# EAGLE design TankFuzz (EAGLE 9.6.2)
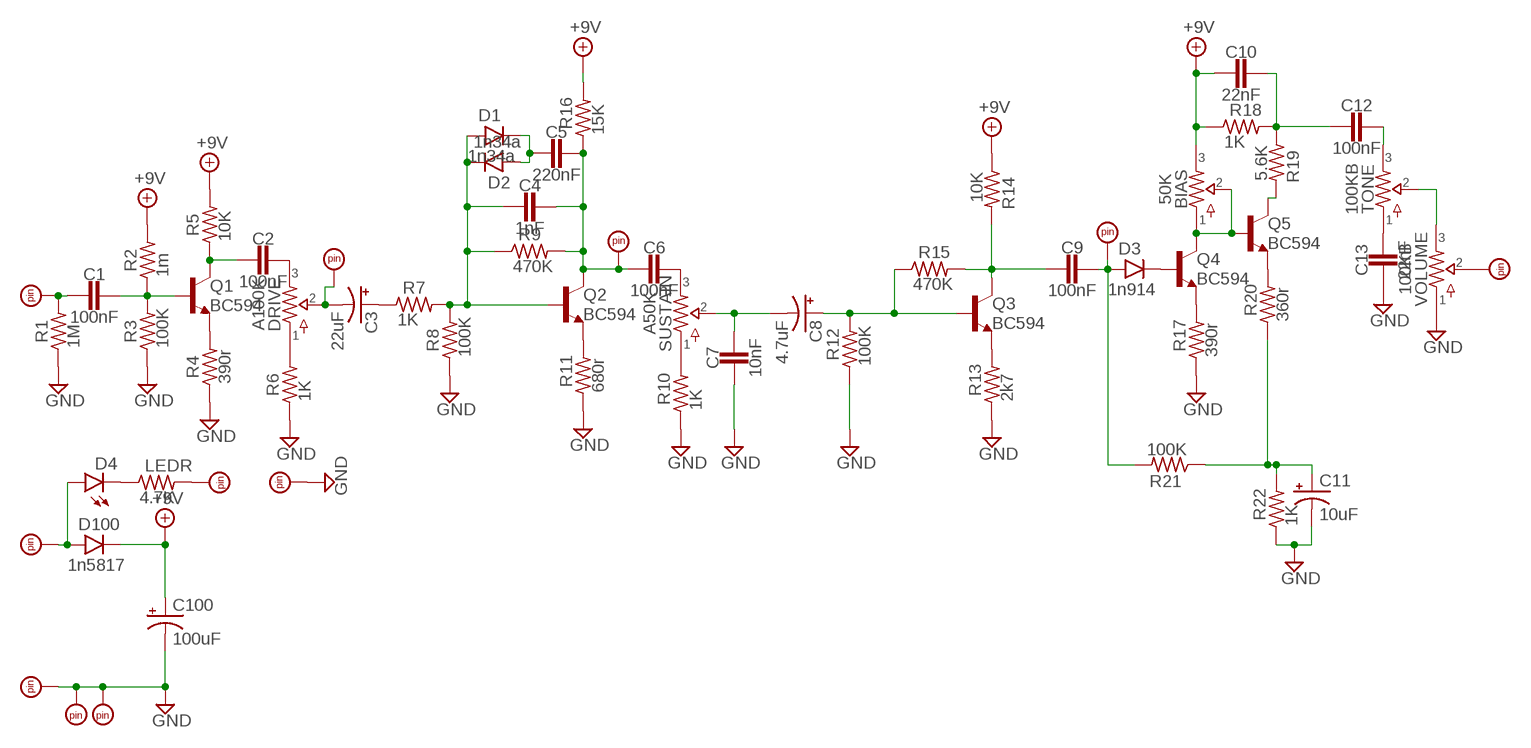
[diagram p0: schematic, sheet 1]

## Parts
BIAS  50K  TRIMMERTRIM3  [TRIM3]
C1  100nF  CAP.3  [0.2".MED]
C2  100nF  CAP.3  [0.2".MED]
C3  22uF  0501  [050_020_1]
C4  1nF  CAP.3  [0.2".MED]
C5  220nF  CAP.3  [0.2".MED]
C6  100nF  CAP.3  [0.2".MED]
C7  10nF  CAP.3  [0.2".MED]
C8  4.7uF  0501  [050_020_1]
C9  100nF  CAP.3  [0.2".MED]
C10  22nF  CAP.3  [0.2".MED]
C11  10uF  0501  [050_020_1]
C12  100nF  CAP.3  [0.2".MED]
C13  22nF  CAP.3  [0.2".MED]
C100  100uF  0501  [050_020_1]
D1  1n34a  DO35.3  [DO35-3]
D2  1n34a  DO35.3  [DO35-3]
D3  1n914  DO35.3  [DO35-3]
D4  LED3MM  [LED3MM]
D100  1n5817  DO41.3  [DO41-3]
DRIVE  A100K  16MM.1  [16MM_B.MOUNT]
LEDR  4.7K  RESISTORS.3B  [R0207/3]
Q1  BC594  2N5088  [TO92]
Q2  BC594  2N5088  [TO92]
Q3  BC594  2N5088  [TO92]
Q4  BC594  2N5088  [TO92]
Q5  BC594  2N5088  [TO92]
R1  1M  RESISTORS.3B  [R0207/3]
R2  1m  RESISTORS.3B  [R0207/3]
R3  100K  RESISTORS.3B  [R0207/3]
R4  390r  RESISTORS.3B  [R0207/3]
R5  10K  RESISTORS.3B  [R0207/3]
R6  1K  RESISTORS.3B  [R0207/3]
R7  1K  RESISTORS.3B  [R0207/3]
R8  100K  RESISTORS.3B  [R0207/3]
R9  470K  RESISTORS.3B  [R0207/3]
R10  1K  RESISTORS.3B  [R0207/3]
R11  680r  RESISTORS.3B  [R0207/3]
R12  100K  RESISTORS.3B  [R0207/3]
R13  2k7  RESISTORS.3B  [R0207/3]
R14  10K  RESISTORS.3B  [R0207/3]
R15  470K  RESISTORS.3B  [R0207/3]
R16  15K  RESISTORS.3B  [R0207/3]
R17  390r  RESISTORS.3B  [R0207/3]
R18  1K  RESISTORS.3B  [R0207/3]
R19  5.6K  RESISTORS.3B  [R0207/3]
R20  360r  RESISTORS.3B  [R0207/3]
R21  100K  RESISTORS.3B  [R0207/3]
R22  1K  RESISTORS.3B  [R0207/3]
SUSTAIN  A50K  16MM.1  [16MM_B.MOUNT]
TONE  100KB  16MM.1  [16MM_B.MOUNT]
U$1  PADS.RND_NL  [PAD2]
U$2  PADS.RND_NL  [PAD2]
U$3  PADS.RND_NL  [PAD2]
U$4  PADS.RND_NL  [PAD2]
U$5  PADS.RND_NL  [PAD2]
U$6  PADS.RND_NL  [PAD2]
U$8  PADS.RND_NL  [PAD2]
U$9  PADS.RND_NL  [PAD2]
U$10  PADS.RND_NL  [PAD2]
U$11  PADS.RND_NL  [PAD2]
U$12  PADS.RND_NL  [PAD2]
VOLUME  100KB  16MM.1  [16MM_B.MOUNT]

## Nets
+9V: BIAS.3 BIAS.6 C10.2 C100.+ D100.C R2.2 R5.2 R14.1 R16.2 R18.1
GND: C7.2 C11.- C13.2 C100.- R1.1 R3.1 R4.1 R6.1 R8.1 R10.1 R11.1 R12.1 R13.1 R17.1 R22.1 U$4.P$1 U$6.P$1 U$8.P$1 U$9.P$1 VOLUME.1
N$1: C1.2 R1.2 U$1.P$1
N$2: C1.1 Q1.2(B) R2.1 R3.2
N$3: Q1.3(E) R4.2
N$4: C2.2 Q1.1(C) R5.1
N$5: C2.1 DRIVE.3
N$6: DRIVE.1 R6.2
N$7: C3.- DRIVE.2 U$10.P$1
N$8: C3.+ R7.1
N$9: C6.1 SUSTAIN.3
N$10: Q2.3(E) R11.2
N$11: C4.1 C5.1 C6.2 Q2.1(C) R9.2 R16.1 U$11.P$1
N$12: C5.2 D1.C D2.A
N$13: C4.2 D1.A D2.C Q2.2(B) R7.2 R8.2 R9.1
N$14: R10.2 SUSTAIN.1
N$15: C7.1 C8.- SUSTAIN.2
N$16: C8.+ Q3.2(B) R12.2 R15.1
N$17: Q3.3(E) R13.2
N$18: C9.2 Q3.1(C) R14.2 R15.2
N$19: C9.1 D3.A R21.2 U$12.P$1
N$20: D3.C Q4.2(B)
N$21: Q4.3(E) R17.2
N$22: BIAS.1 BIAS.2 BIAS.4 BIAS.5 Q4.1(C) Q5.2(B)
N$23: C12.1 TONE.3
N$24: C10.1 C12.2 R18.2 R19.1
N$25: Q5.1(C) R19.2
N$26: Q5.3(E) R20.2
N$27: C11.+ R20.1 R21.1 R22.2
N$28: TONE.2 VOLUME.3
N$29: C13.1 TONE.1
N$30: U$2.P$1 VOLUME.2
N$31: LEDR.2 U$5.P$1
N$33: D4.A D100.A U$3.P$1
N$34: D4.K(C) LEDR.1

## Library data of the parts
BIAS = potentiometers:TRIMMER: Trimpots
C1 C2 C4-C7 C9 C10 C12 C13 = caps-film:CAP: For Ceramic, Film, MLCC caps
C3 C8 C11 C100 = caps-elec:050: 0.22 - 100uF Xicon values at Mouser.com: 10V: 10 - 100uF; 16V: 2.2 - 47uF; 25V: 0.47 - 47uF; 50V: 0.22 - 22uF
D1-D3 = diodes:DO35: DO-35 Package Diodes: 1N914
D4 = diodes:LED
D100 = diodes:DO41: DO-41 Package Diodes: 1N4001 - 1N40019 Zener Diodes: 1N4728 - 1N4764
DRIVE SUSTAIN TONE VOLUME = potentiometers:16MM: 16mm Poteniometers
LEDR R1-R22 = resistors:RESISTORS
Q1-Q5 = transistors-BJT:2N5088: NPN - 2n5088, 2n5089, 2n3904, MPSA18 [C]-B-E pinout 2n5088: http://smallbear-electronics.mybigcommerce.com/transistor-2n5088/ 2n5089: http://smallbear-electronics.mybigcommerce.com/transistor-2n5089/ 2n5089: http://smallbear-electronics.mybigcommerce.com/transistor-2n5089-motorola/ 2n3904: http://smallbear-electronics.mybigcommerce.com/transistor-2n3904/ MPSA18: http://smallbear-electronics.mybigcommerce.com/transistor-mpsa18/
U$1-U$6 U$8-U$12 = supply pins:PADS.: Pads For I/O connections or test point pads on PCBs.

## Board
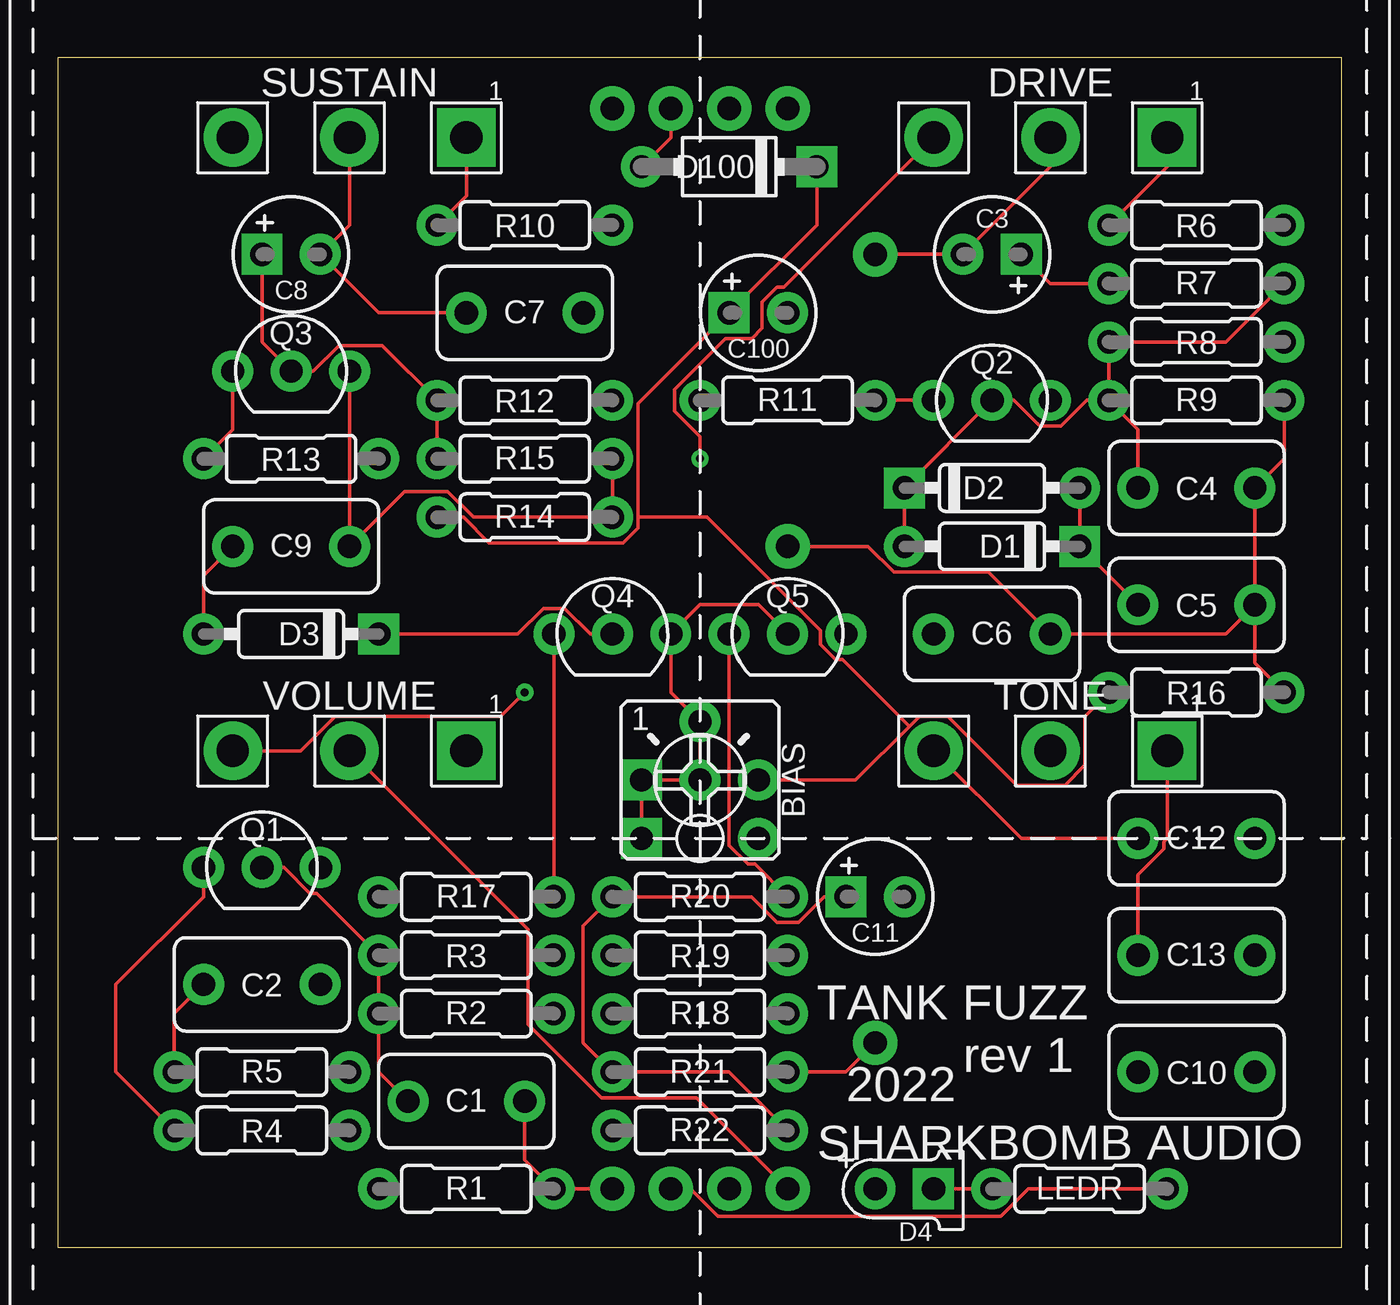
[diagram p1: board, top side]
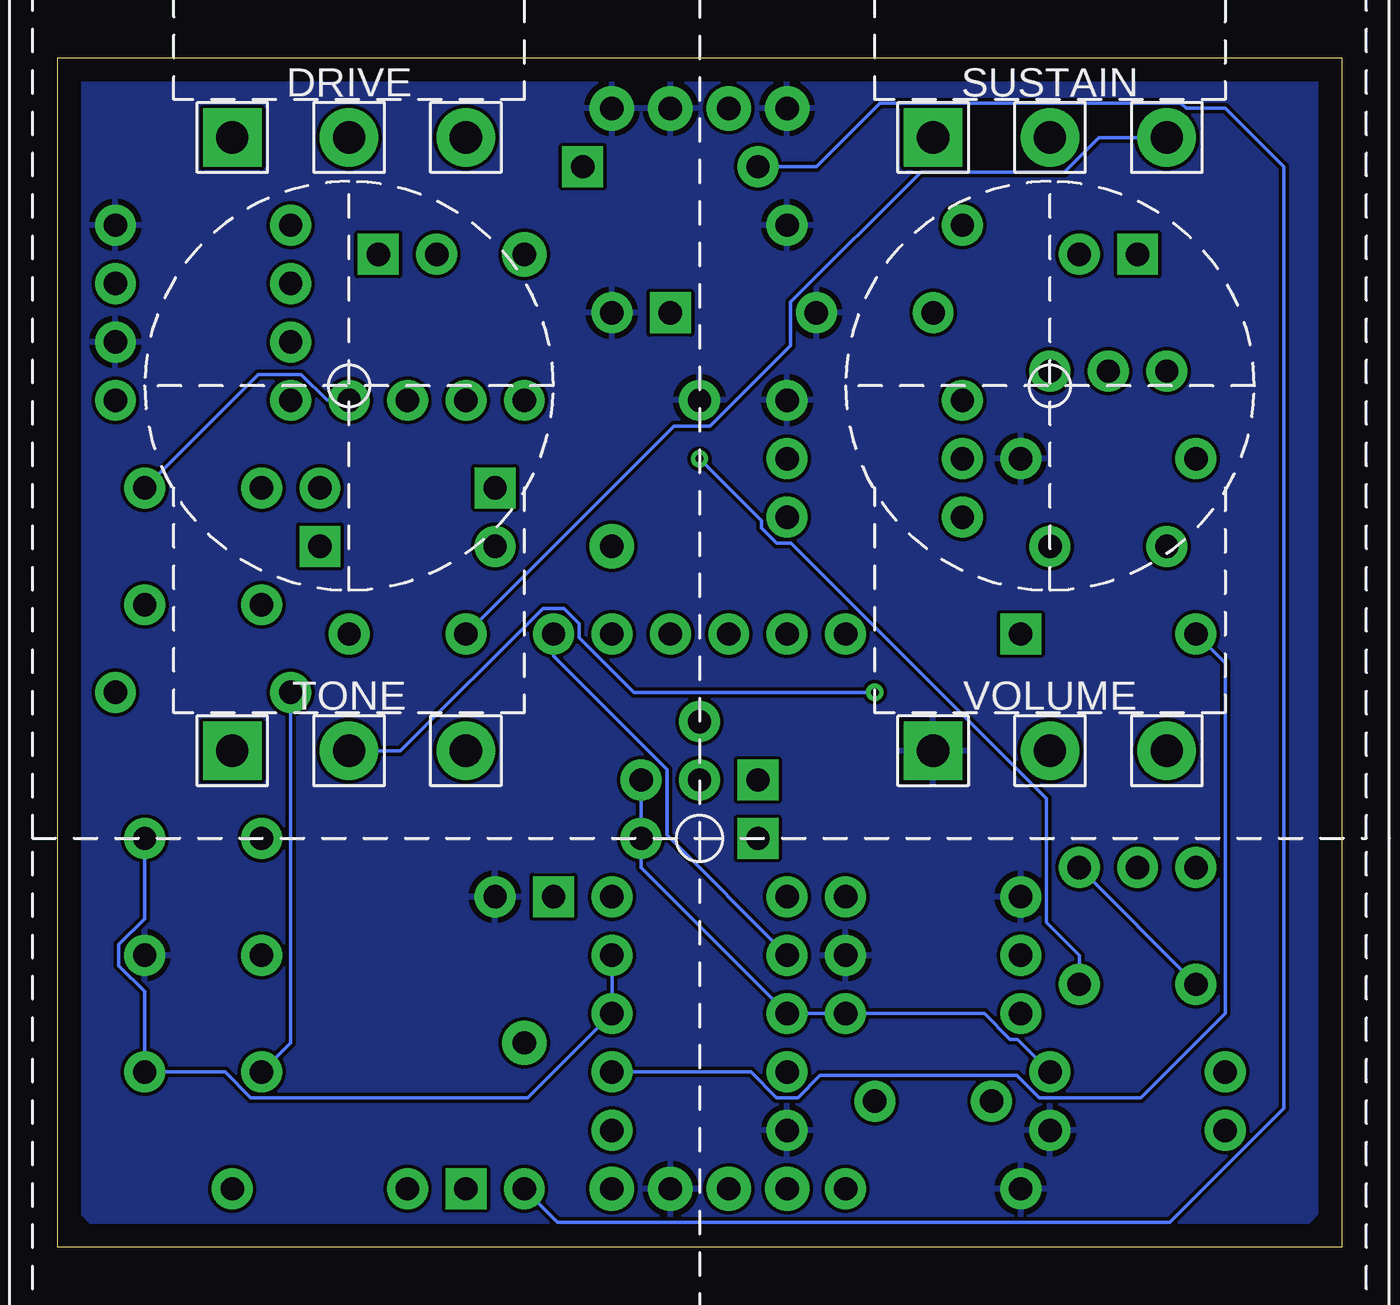
[diagram p2: board, bottom side, seen from below]

Size 55.86 x 51.74 mm. Coordinates in mm from the lower left corner, seen from the top.
Outline: 0,0 55.86,0 55.86,51.74 0,51.74 0,0
Copper layers (1*16): Top 0.035mm / dielectric 1.5mm / Bottom 0.035mm
Design rules "default": minimum track width 6mil, minimum drill 0.35mm, track to track 6mil, track to pad 6mil, pad to pad 6mil, via to via 6mil, smd to smd 6mil, copper to edge 40mil, drill to drill 6mil, minimum pad ring 10mil, minimum via ring 8mil, stop-mask expansion 4mil, vias tented up to drill 0mil, thermal gap 10mil

### Footprints (pad centres in the part's own frame; a part is rotated, then mirrored left to right if it is on the bottom)
TRIM3 = drill 1.016 pad 1.778 square: 1 -2.54,0; 4 -2.54,-2.54 | drill 1.016 pad 1.778: 2 0,2.54; 3 2.54,0; 5 0,0; 6 2.54,-2.54
0.2".MED = drill 1.016 pad 1.778: 1 -2.54,0; 2 2.54,0
050_020_1 = drill 1.016 pad 1.778 square: + -1.27,0 | drill 1.016 pad 1.778: - 1.27,0
DO35-3 = drill 1.016 pad 1.778: A 3.81,0 | drill 1.016 pad 1.778 square: C -3.81,0
LED3MM = drill 1.016 pad 1.778: A -1.27,0 | drill 1.016 pad 1.778 square: K 1.27,0
DO41-3 = drill 1.016 pad 1.778: A 3.81,0 | drill 1.016 pad 1.778 square: C -3.81,0
16MM_B.MOUNT = drill 1.4 pad 2.54 square: 1 5.08,0 | drill 1.4 pad 2.54: 2 0,0; 3 -5.08,0
R0207/3 = drill 1.016 pad 1.778: 1 -3.81,0; 2 3.81,0
TO92 = drill 1.016 pad 1.778: 1 -2.54,0; 2 0,0; 3 2.54,0
PAD2 = drill 1.016 pad 1.93: P$1 0,0

### Placement (x,y rotation side)
BIAS  27.94,20.32 0 top
C1  17.78,6.35 0 top
C2  8.89,11.43 180 top
C3  40.64,43.18 180 top
C4  49.53,33.02 180 top
C5  49.53,27.94 180 top
C6  40.64,26.67 0 top
C7  20.32,40.64 0 top
C8  10.16,43.18 0 top
C9  10.16,30.48 0 top
C10  49.53,7.62 180 top
C11  35.56,15.24 0 top
C12  49.53,17.78 0 top
C13  49.53,12.7 0 top
C100  30.48,40.64 0 top
D1  40.64,30.48 180 top
D2  40.64,33.02 0 top
D3  10.16,26.67 180 top
D4  36.83,2.54 0 top
D100  29.21,46.99 180 top
DRIVE  43.18,48.26 0 top
LEDR  44.45,2.54 0 top
Q1  8.89,16.51 180 top
Q2  40.64,36.83 180 top
Q3  10.16,38.1 180 top
Q4  24.13,26.67 180 top
Q5  31.75,26.67 180 top
R1  17.78,2.54 0 top
R2  17.78,10.16 0 top
R3  17.78,12.7 180 top
R4  8.89,5.08 180 top
R5  8.89,7.62 0 top
R6  49.53,44.45 180 top
R7  49.53,41.91 0 top
R8  49.53,39.37 180 top
R9  49.53,36.83 0 top
R10  20.32,44.45 180 top
R11  31.75,36.83 0 top
R12  20.32,36.83 180 top
R13  10.16,34.29 180 top
R14  20.32,31.75 0 top
R15  20.32,34.29 0 top
R16  49.53,24.13 180 top
R17  17.78,15.24 0 top
R18  27.94,10.16 0 top
R19  27.94,12.7 180 top
R20  27.94,15.24 0 top
R21  27.94,7.62 0 top
R22  27.94,5.08 0 top
SUSTAIN  12.7,48.26 0 top
TONE  43.18,21.59 0 top
U$1  24.13,2.54 0 top
U$2  31.75,2.54 0 top
U$3  26.67,49.53 0 top
U$4  29.21,2.54 0 top
U$5  26.67,2.54 0 top
U$6  29.21,49.53 0 top
U$7  [125B]  27.94,17.78 0 top
U$8  24.13,49.53 0 top
U$9  31.75,49.53 0 top
U$10  35.56,43.18 0 top
U$11  31.75,30.48 0 top
U$12  35.56,8.89 0 top
VOLUME  12.7,21.59 0 top

### Tracks (layer width: path | path; a pad name or v marks a point on that pad's centre or on a via)
+9V
  Top 0.152: D100.C 33.02,44.45 C100.+ 25.25,36.68 25.25,31.75 | R14.1 17.66,31.75 18.78,30.63 24.59,30.63 25.25,31.29 25.25,31.75 | R16.2 44.68,23.09 44.68,20.97 43.8,20.09 41.72,20.09 38.72,23.09 37.48,23.09 37.04,22.65 | BIAS.3 34.71,20.32 37.04,22.65 | 37.04,22.65 34.14,25.55 33.83,25.55 33.17,26.21 33.17,26.83 28.25,31.75 25.25,31.75
  Bottom 0.152: R5.2 14.12,9.04 14.43,9.04 15.55,10.16 R2.2 R18.1 30.48,16.51 BIAS.6 BIAS.3 | C10.2 45.72,8.89 R16.2
GND
  pour Bottom: 0,50.8 54.61,50.8 55.88,49.53 55.88,2.54 53.34,0 2.54,0 0,2.54
N$1
  Top 0.152: U$1.P$1 R1.2 20.32,3.81 C1.2
N$2
  Top 0.152: C1.1 13.97,7.62 R2.1 R3.2 11.28,15.39 10.97,15.39 9.85,16.51 Q1.2
N$3
  Top 0.152: Q1.3 6.35,15.24 2.54,11.43 2.54,7.62 R4.2
N$4
  Top 0.152: R5.1 5.08,10.16 C2.2
  Bottom 0.152: C2.2 Q1.1
N$5  (via drill 0.35)
  Top 0.152: DRIVE.3 31.6,41.76 31.29,41.76 30.63,41.1 30.63,39.96 30.19,39.52 29.05,39.52 26.82,37.29 26.82,36.37 27.94,35.25 v27.94,34.29
  Bottom 0.152: C2.1 11.43,12.7 12.85,14.12 12.85,19.53 23.96,30.63 24.59,30.63 25.25,31.29 25.25,31.6 v27.94,34.29
N$6
  Top 0.152: DRIVE.1 48.26,46.99 R6.2
N$7
  Top 0.152: DRIVE.2 43.18,46.99 C3.- U$10.P$1
N$8
  Top 0.152: R7.1 43.18,41.91 C3.+
N$9
  Bottom 0.152: C6.1 29.06,35.71 27.48,35.71 23.98,39.21 23.98,41.1 18.32,46.76 12.08,46.76 10.58,48.26 SUSTAIN.3
N$10
  Top 0.152: R11.2 Q2.3
N$11
  Top 0.152: R9.2 53.34,34.29 C4.1 C5.1 | R16.1 52.07,25.4 C5.1 | C5.1 50.8,26.67 C6.2 40.49,29.36 36.37,29.36 35.25,30.48 U$11.P$1
  Bottom 0.152: Q2.1 44.14,36.83 45.26,37.95 47.14,37.95 C4.1
N$12
  Top 0.152: C5.2 D1.C D2.A
N$13
  Top 0.152: R7.2 50.8,39.37 R8.2 R9.1 | R9.1 46.99,35.56 C4.2 | R9.1 44.76,36.83 43.64,35.71 42.72,35.71 41.6,36.83 Q2.2 D2.C D1.A
N$14
  Top 0.152: SUSTAIN.1 17.78,45.72 R10.2
N$15
  Top 0.152: SUSTAIN.2 12.7,44.45 C8.- 13.97,40.64 C7.1
N$16
  Top 0.152: R15.1 R12.2 14.12,39.22 12.24,39.22 11.12,38.1 Q3.2 8.89,39.37 C8.+
N$17
  Top 0.152: Q3.3 7.62,35.56 R13.2
N$18
  Top 0.152: Q3.1 C9.2 15.09,32.87 16.97,32.87 18.09,31.75 R14.2 R15.2
N$19
  Top 0.152: D3.A 6.35,29.21 C9.1 | R21.2 34.29,7.62 U$12.P$1
  Bottom 0.152: R21.2 25.71,7.62 24.59,6.5 23.67,6.5 22.7,7.47 14.13,7.47 13.16,6.5 8.74,6.5 5.08,10.16 5.08,25.4 D3.A
N$20
  Top 0.152: Q4.2 23.17,26.67 22.05,27.79 21.13,27.79 20.01,26.67 D3.C
N$21
  Top 0.152: Q4.3 R17.2
N$22
  Top 0.152: BIAS.4 BIAS.1 BIAS.5 BIAS.2 26.67,24.13 Q4.1 27.94,27.94 30.48,27.94 Q5.2
N$23
  Top 0.152: C12.1 41.91,17.78 TONE.3
N$24
  Bottom 0.152: C12.2 52.07,14.28 53.19,13.16 53.19,12.24 52.07,11.12 C10.1 48.57,7.62 47.45,6.5 35.41,6.5 R18.2 R19.1
N$25
  Bottom 0.152: R19.2 29.36,17.93 29.36,20.78 34.29,25.71 Q5.1
N$26
  Top 0.152: R20.2 30.33,16.66 30.02,16.66 29.21,17.47 Q5.3
N$27
  Top 0.152: C11.+ 33.33,15.24 32.21,14.12 31.29,14.12 30.17,15.24 R20.1 22.86,13.97 22.86,8.89 R21.1 29.21,7.62 R22.2
N$28  (via drill 0.35)
  Top 0.152: VOLUME.3 10.58,21.59 12.08,23.09 19.28,23.09 v20.32,24.13
  Bottom 0.152: v20.32,24.13 30.79,24.13 33.17,26.51 33.17,27.13 33.83,27.79 34.75,27.79 40.95,21.59 TONE.2
N$29
  Top 0.152: C13.1 46.99,16.2 48.11,17.32 48.11,17.63 48.26,17.78 TONE.1
N$30
  Top 0.152: VOLUME.2 20.47,13.82 20.47,9.7 23.67,6.5 27.79,6.5 U$2.P$1
N$31
  Top 0.152: LEDR.2 42.22,2.54 41.03,1.35 28.72,1.35 27.52,2.54 U$5.P$1
N$33
  Top 0.152: D100.A 26.67,48.26 U$3.P$1
  Bottom 0.152: D100.A 22.86,46.99 20.09,49.76 7,49.76 6.77,49.53 5.08,49.53 2.54,46.99 2.54,6.04 7.49,1.09 34.11,1.09 D4.A
N$34
  Top 0.152: LEDR.1 D4.K

### Text on the board
tNames: TANK FUZZ | rev 1 | 2022 | SHARKBOMB AUDIO